# EAGLE design sqare_inch_challenge (EAGLE 9.1.0)
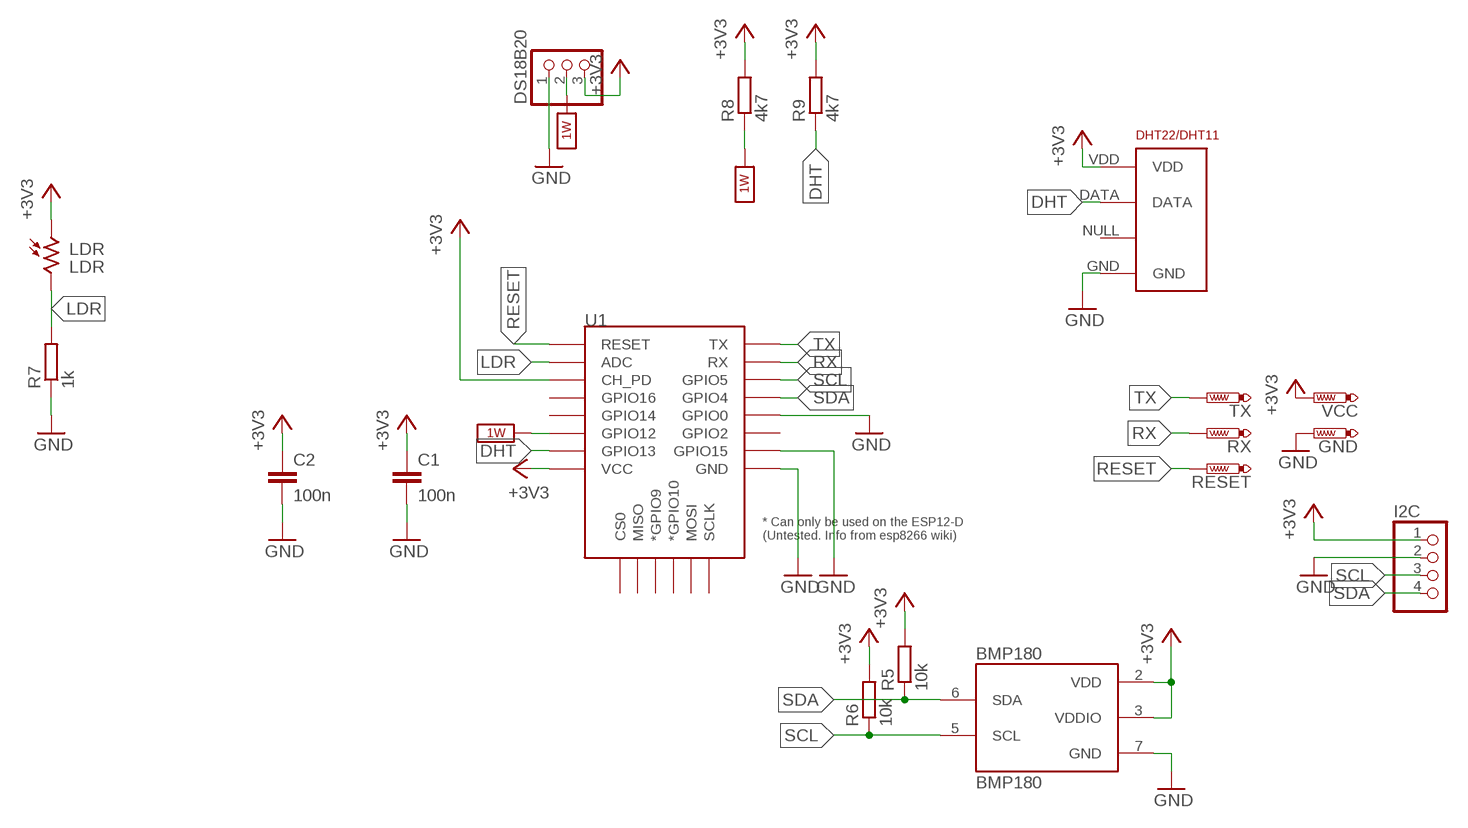
[diagram p0: schematic, sheet 1]

## Parts
BMP180  BMP180  [BMP180]
C1  100n  C-EUC0805  [C0805]
C2  100n  C-EUC0805  [C0805]
DHT22/DHT11  RHT03_DHT-22_AM2302  [RHT03_DHT-22]
DS18B20  PINHD-1X3  [1X03]
GND  GND  PTR1TP17SQ  [TP17SQ]
I2C  PINHD-1X4  [1X04]
LDR  LDR  A1050_13  [T0-46-A10XX]
R5  10k  R-EU_R0805  [R0805]
R6  10k  R-EU_R0805  [R0805]
R7  1k  R-EU_R0805  [R0805]
R8  4k7  R-EU_R0805  [R0805]
R9  4k7  R-EU_R0805  [R0805]
RESET  PTR1TP17SQ  [TP17SQ]
RX  PTR1TP17SQ  [TP17SQ]
TX  PTR1TP17SQ  [TP17SQ]
U1  ESP12ESMD  [ESP12E-SMD]
VCC  +3V3  PTR1TP17SQ  [TP17SQ]

## Nets
1W: DS18B20.2 R8.1 U1.GPIO12 ; supply symbol labelled 1W_SUP
+3V3: BMP180.2(VDD) BMP180.3(VDDIO) C1.1 C2.1 DHT22/DHT11.VDD DS18B20.3 I2C.1 LDR.1 R5.2 R6.2 R8.2 R9.2 U1.CH_PD U1.VCC VCC.TP
DHT: DHT22/DHT11.DATA R9.1 U1.GPIO13
GND: BMP180.7(GND) C1.2 C2.2 DHT22/DHT11.GND DS18B20.1 GND.TP I2C.2 R7.1 U1.GND U1.GPIO0 U1.GPIO15
LDR: LDR.2 R7.2 U1.ADC
RESET: RESET.TP U1.RESET
RX: RX.TP U1.RXD0(RX)
SCL: BMP180.5(SCL) I2C.3 R6.1 U1.GPIO5
SDA: BMP180.6(SDA) I2C.4 R5.1 U1.GPIO4
TX: TX.TP U1.TXD0(TX)
Unconnected: DHT22/DHT11.NULL U1.CS0 U1.GPIO2 U1.GPIO9(*GPIO9) U1.GPIO10(*GPIO10) U1.GPIO14 U1.GPIO16 U1.MISO U1.MOSI U1.SCLK

## Library data of the parts
BMP180 = BMP180:BMP180: BOSCH BMP180 DIGITAL BAROMETRIC PRESSURE SENSOR Web page: http://www.bosch-sensortec.com/en/homepage/products_3/environmental_sensors_1/bmp180_1/bmp180 Datasheet: http://ae-bst.resource.bosch.com/media/products/dokumente/bmp180/BST-BMP180-DS000-09.pdf The BMP180 is the function compatible successor of the BMP085, a new generation of high precision digital pressure sensors for consumer applications. The ultra-low power, low voltage electronics of the BMP180 is optimized for use in mobile phones, PDAs, GPS navigation devices and outdoor equipment. With a low altitude noise of merely 0.25m at fast conversion time, the BMP180 offers superior performance. The I2C interface allows for easy system integration with a microcontroller. The BMP180 is based on piezo-resistive technology for EMC robustness, high accuracy and linearity as well as long term stability. Key features: - Temperature measurement included - I2C interface - Fully calibrated - Pb-free, halogen-free and RoHS compliant, - MSL 1 Basic specs: Pressure range: 300 to 1100hPa (+9000m to -500m relating to sea level) Supply voltage: 1.8 to 3.6V (VDD), 1.62V to 3.6V (VDDIO) Package: LGA package with metal lid Small footprint: 3.6mm x 3.8mm Super-flat: 0.93mm height Low power: 5µA at 1 sample / sec. in standard mode Low noise: 0.06hPa (0.5m) in ultra low power mode, 0.02hPa (0.17m) advanced resolution mode Typical applications: - Enhancement of GPS navigation (dead-reckoning, slope detection, etc.) - In- and out-door navigation - Leisure and sports - Weather forecast - Vertical velocity indication (rise/sink speed)
C1 C2 = rcl:C-EU: CAPACITOR, European symbol; SPICEPREFIX: C
DHT22/DHT11 = Square_inch_Challange:RHT03_DHT-22_AM2302: RHT03 / DHT-22 / AM2302 Packages and symbol for the RHT03 / DHT-22 relative humidity and temperature sensor. Note: The AM2302 is a wired version of the DHT-22 which typically requires less clearance and is thus provided as a separate package.; PROD_ID: SEN-10167
DS18B20 = pinhead:PINHD-1X3: PIN HEADER
GND RESET RX TX VCC = testpad:PTR1: TEST PIN
I2C = pinhead:PINHD-1X4: PIN HEADER
LDR = Square_inch_Challange:A10: Sensor Robust Light Sensing Applications Outdoor Light Sensing Application Source: http://optoelectronics.perkinelmer.com/content/Datasheets/DTS_PhotocellsA1050.pdf
R5-R9 = rcl:R-EU_: RESISTOR, European symbol; SPICEPREFIX: R
U1 = Square_inch_Challange:ESP12E: ESP12E Module

## Board
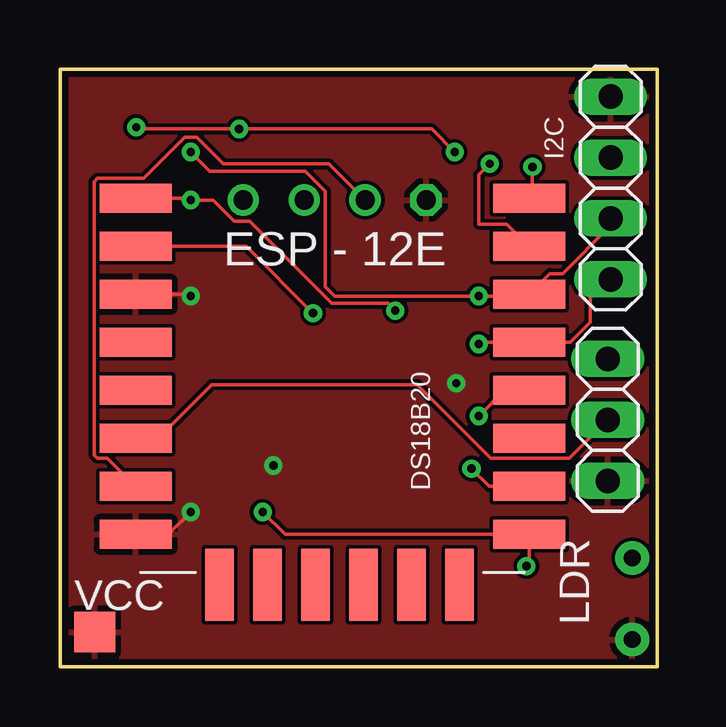
[diagram p1: board, top side]
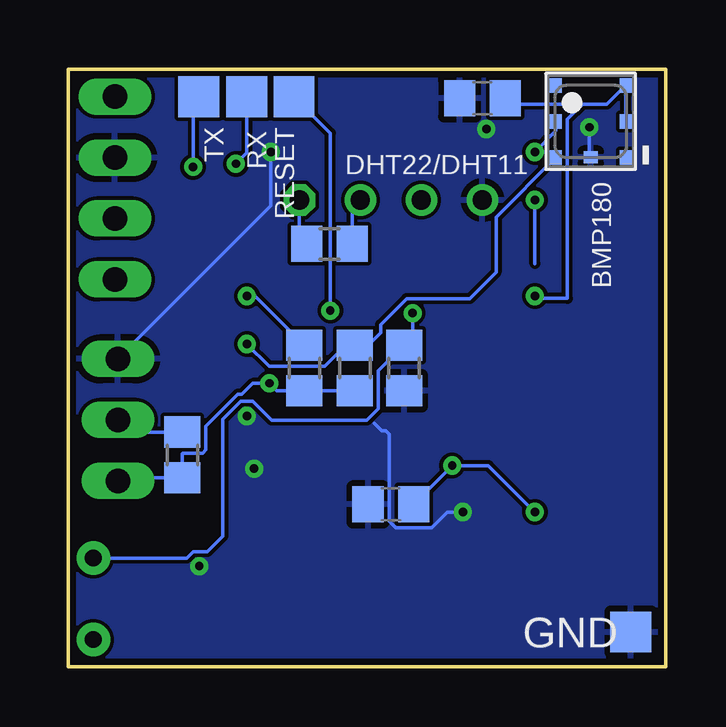
[diagram p2: board, bottom side, seen from below]

Size 24.89 x 24.89 mm. Coordinates in mm from the lower left corner, seen from the top.
Outline: 0,0 24.89,0 24.89,24.89 0,24.89 0,0
Copper layers (1*16): Top 0.035mm / dielectric 1.5mm / Bottom 0.035mm
Design rules "default *": minimum track width 6mil, minimum drill 0.35mm, track to track 6mil, track to pad 6mil, pad to pad 6mil, via to via 6mil, smd to smd 6mil, copper to edge 10mil, drill to drill 6mil, minimum pad ring 10mil, minimum via ring 8mil, stop-mask expansion 4mil, vias tented up to drill 0mil, thermal gap 10mil
Milling: 4 lines

### Footprints (pad centres in the part's own frame; a part is rotated, then mirrored left to right if it is on the bottom)
BMP180 = smd 0.6 x 0.5: 1 1.5,1.45; 2 0,1.45; 3 -1.5,1.45; 4 -1.5,-1.45; 5 0,-1.45; 6 1.5,-1.45 | smd 0.5 x 0.6: 7 1.5,0
C0805 = smd 1.3 x 1.5: 1 -0.95,0; 2 0.95,0
RHT03_DHT-22 = drill 0.8: DATA -1.27,0; GND 3.81,0; NULL 1.27,0 | drill 0.8 octagon: VDD -3.81,0
1X03 = drill 1.016 long: 1 -2.54,0; 2 0,0; 3 2.54,0
TP17SQ = smd 1.7 x 1.7: TP 0,0
1X04 = drill 1.016 long: 1 -3.81,0; 2 -1.27,0; 3 1.27,0; 4 3.81,0
T0-46-A10XX = drill 0.7 pad 1.4: 1 -1.7,0; 2 1.7,0
R0805 = smd 1.3 x 1.5: 1 -0.95,0; 2 0.95,0
ESP12E-SMD = smd 3 x 1.2: ADC -8.3,3.8; CH_PD -8.3,1.8; GND 8.1,-8.2; GPIO0 8.1,-2.2; GPIO2 8.1,-4.2; GPIO4 8.1,-0.2; GPIO5 8.1,1.8; GPIO12 -8.3,-4.2; GPIO13 -8.3,-6.2; GPIO14 -8.3,-2.2; GPIO15 8.1,-6.2; GPIO16 -8.3,-0.2; RESET -8.3,5.8; RXD0 8.1,3.8; TXD0 8.1,5.8; VCC -8.3,-8.2 | smd 1.2 x 3: CS0 -4.8,-10.3; GPIO9 -0.8,-10.3; GPIO10 1.2,-10.3; MISO -2.8,-10.3; MOSI 3.2,-10.3; SCLK 5.2,-10.3

### Placement (x,y rotation side)
BMP180  3.12,22.72 270 bottom
C1  7.63,23.69 180 bottom
C2  11.45,6.77 180 bottom
DHT22/DHT11  11.45,19.45 0 bottom
DS18B20  22.82,10.29 270 top
GND  1.45,1.45 0 bottom
I2C  22.95,19.95 270 top
LDR  23.84,2.83 90 top
R5  12.95,12.45 270 bottom
R6  15.05,12.45 270 bottom
R7  10.9,12.45 90 bottom
R8  20.13,8.83 270 bottom
R9  14,17.62 180 bottom
RESET  15.48,23.75 0 bottom
RX  17.45,23.75 0 bottom
TX  19.45,23.75 0 bottom
U1  11.45,13.72 0 top
VCC  1.45,1.45 0 top

### Tracks (layer width: path | path; a pad name or v marks a point on that pad's centre or on a via)
1W
  Top 0.152: U1.GPIO12 4.08,9.52 6.32,11.75 14.89,11.75 17.95,8.69 21.22,8.69 DS18B20.2
  Bottom 0.152: R8.1 22.31,9.78 DS18B20.2
+3V3  (via drill 0.35)
  Top 0.152: v5.45,6.45 4.52,5.52 U1.VCC | v5.45,15.45 5.38,15.52 U1.CH_PD
  Bottom 0.152: BMP180.2 BMP180.3 2.45,23.45 3.45,23.45 | 3.45,23.45 6.68,23.45 | 3.45,23.45 4.09,22.8 4.09,15.34 5.34,15.34 v5.45,15.45 | R5.2 R6.2 16.2,11.5 v16.51,11.81 17.2,11.81 17.65,11.36 17.82,11.36 19.15,10.03 19.15,9.03 19.29,8.9 20.11,8.9 20.13,8.88 R8.2 22.69,7.88 DS18B20.3 | v5.45,6.45 7.38,8.38 v8.89,8.38 C2.1 | DHT22/DHT11.VDD 15.26,17.92 R9.2
  Bottom 0.305: 6.68,23.45 C1.1
  pour Top: -0.05,24.95 24.95,24.95 24.95,-0.15 -0.05,-0.15
DHT
  Top 0.152: U1.GPIO13 1.97,8.69 1.55,8.69 1.42,8.82 1.42,20.21 1.55,20.34 3.49,20.34 5.19,22.05 5.7,22.05 6.8,20.95 11.21,20.95 DHT22/DHT11.DATA
  Bottom 0.152: R9.1 13.05,19.11 DHT22/DHT11.DATA
GND  (via drill 0.35)
  Top 0.152: v19.43,4.19 19.55,4.31 U1.GND 9.38,5.52 v8.45,6.45 | v3.17,22.48 3.25,22.41 v7.47,22.41 15.49,22.41 v16.45,21.45 | v17.14,8.25 17.88,7.52 U1.GPIO15 | v17.45,10.45 18.52,11.52 U1.GPIO0
  Bottom 0.152: v3.17,22.48 3.17,21.28 BMP180.7 | 12.14,10.14 11.82,9.82 11.65,9.82 11.52,9.69 11.52,6.06 11.24,5.79 9.75,5.79 9.09,6.45 v8.45,6.45 | DS18B20.1 16.45,19.2 v16.45,21.45
  pour Bottom: -0.05,24.95 24.95,24.95 24.95,-0.05 -0.05,-0.05
LDR  (via drill 0.35)
  Top 0.152: U1.ADC 7.76,17.52 v10.54,14.73
  Bottom 0.152: v10.54,14.73 10.54,13.75 R7.2 11.97,12.32 11.97,10.75 12.45,10.27 16.41,10.27 17.2,11.05 17.7,11.05 18.45,10.3 18.45,5.45 19.09,4.8 19.68,4.8 19.95,4.53 LDR.2
RESET  (via drill 0.35)
  Top 0.152: U1.RESET 5.38,19.52 v5.45,19.45 6.39,19.45 7.27,18.56 7.9,18.56 11.32,15.14 13.67,15.14 v13.97,14.84
  Bottom 0.152: 5.45,16.8 v5.45,19.45 | v13.97,14.84 13.97,22.24 RESET.TP
RX  (via drill 0.35)
  Top 0.152: v17.91,20.95 17.45,20.49 17.45,18.45 18.62,18.45 U1.RXD0
  Bottom 0.152: RX.TP 17.45,21.42 v17.91,20.95
SCL  (via drill 0.35)
  Top 0.152: I2C.3 22.94,18.36 20.95,16.38 20.41,16.38 U1.GPIO5 19.48,15.45 v17.45,15.45 11.45,15.45 11.06,15.83 11.06,19.81 10.22,20.65 6.24,20.65 v5.45,21.45
  Bottom 0.152: R6.1 17.1,15.45 v17.45,15.45 | BMP180.5 4.57,22.32 v5.45,21.45
SDA  (via drill 0.35)
  Top 0.152: I2C.4 22.1,15.95 22.1,14.35 21.26,13.52 U1.GPIO4 17.52,13.52 v17.45,13.45
  Bottom 0.152: v17.45,13.45 16.52,12.52 14.2,12.52 13.32,13.4 R5.1 12.4,13.4 11.88,13.92 11.88,14.26 10.79,15.34 8.15,15.34 7.06,16.43 7.06,18.73 BMP180.6
TX  (via drill 0.35)
  Top 0.152: v19.68,20.83 19.68,19.66 U1.TXD0
  Bottom 0.152: v19.68,20.83 19.68,23.51 TX.TP

### Text on the board
bValues: StanislavJochman